# EAGLE schematic source_eagle (EAGLE 9.6.2)
COMPANY: ADAFRUIT INDUSTRIES; DRAWN: KTOWN; REV: A
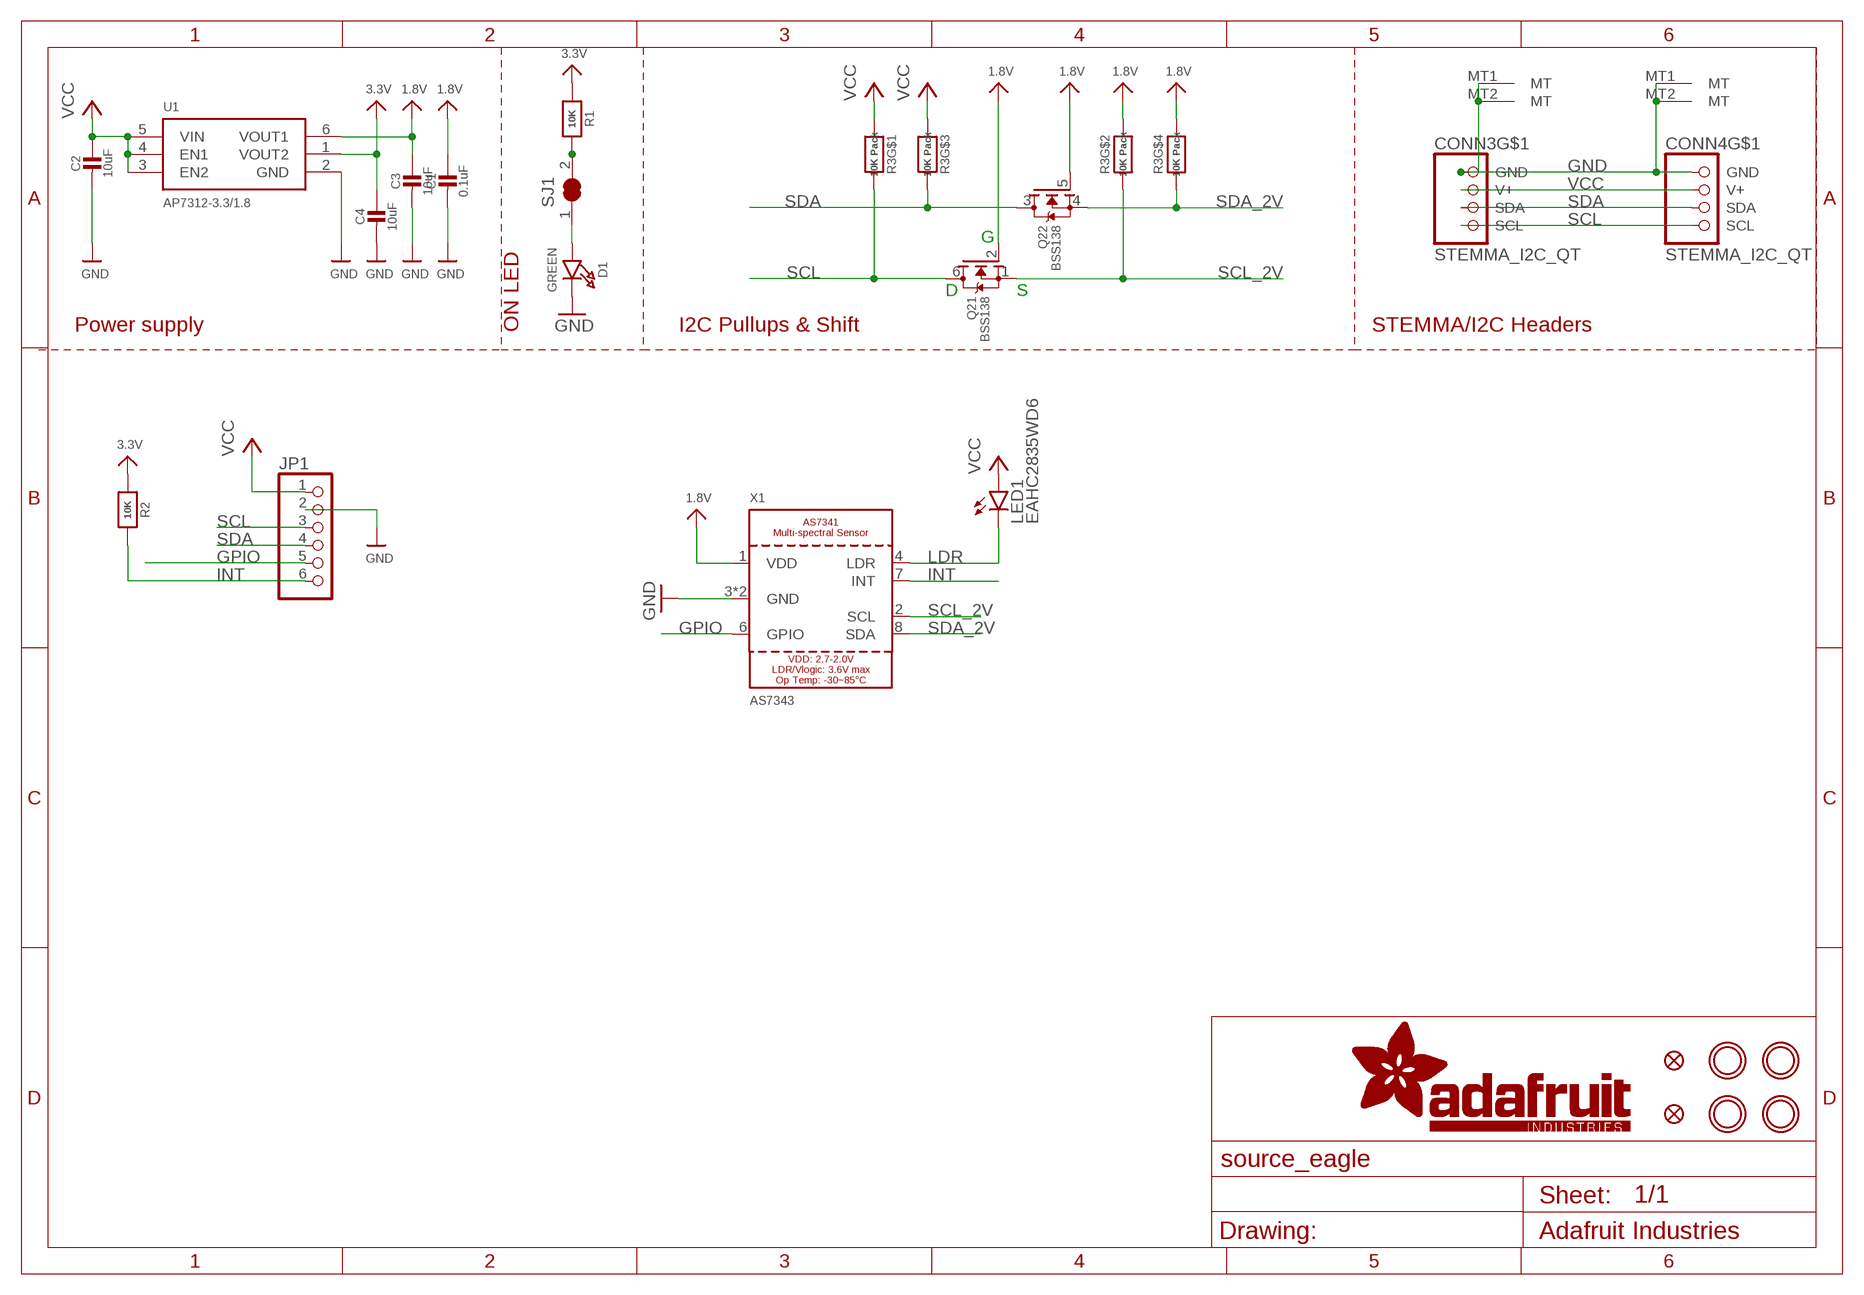
[diagram p0: schematic, sheet 1]

## Parts
C1  0.1uF  CAP_CERAMIC0603_NO  [0603-NO]
C2  10uF  CAP_CERAMIC0805-NOOUTLINE  [0805-NO]
C3  10uF  CAP_CERAMIC0805-NOOUTLINE  [0805-NO]
C4  10uF  CAP_CERAMIC0805-NOOUTLINE  [0805-NO]
CONN3  STEMMA_I2C_QT  [JST_SH4]
CONN4  STEMMA_I2C_QT  [JST_SH4]
D1  GREEN  LED0603_NOOUTLINE  [CHIPLED_0603_NOOUTLINE]
FID3  FIDUCIAL_0.5MM  [FIDUCIAL_0.5MM]
FID4  FIDUCIAL_0.5MM  [FIDUCIAL_0.5MM]
JP1  HEADER-1X670MIL  [1X06_ROUND_70]
LED1  EAHC2835WD6  LEDKA-3528ASYC  [KA-3528ASYC]
Q2  BSS138  MOSFET-N_DUAL  [SOT363]
R1  10K  RESISTOR_0603_NOOUT  [0603-NO]
R2  10K  RESISTOR_0603_NOOUT  [0603-NO]
R3  10K Pack  RESISTOR_4PACK  [RESPACK_4X0603]
SJ1  SOLDERJUMPER_CLOSED  [SOLDERJUMPER_CLOSEDWIRE]
U1  AP7312-3.3/1.8  VREG_SOT23-6_DUALAP7312  [SOT23-6]
U$1  MOUNTINGHOLE2.5  [MOUNTINGHOLE_2.5_PLATED]
U$17  MOUNTINGHOLE2.5  [MOUNTINGHOLE_2.5_PLATED]
U$19  MOUNTINGHOLE2.5  [MOUNTINGHOLE_2.5_PLATED]
U$21  MOUNTINGHOLE2.5  [MOUNTINGHOLE_2.5_PLATED]
X1  AS7343  AS7341  [AS7341]

## Nets
1.8V [lowpower]: C1.1 C3.1 Q2.2(1:G) Q2.5(2:G) R3.2 R3.4 U1.6(VOUT1) X1.1(VDD)
3.3V: C4.1 R1.1 R2.1 U1.1(VOUT2)
GND [highpower]: C1.2 C2.2 C3.2 C4.2 CONN3.1(GND) CONN3.MT1(MT) CONN3.MT2(MT) CONN4.1(GND) CONN4.MT1(MT) CONN4.MT2(MT) D1.C JP1.2 U1.2(GND) X1.3(GND) X1.5(GND)
GPIO: JP1.5 X1.6(GPIO)
INT: JP1.6 R2.2 X1.7(INT)
LDR: LED1.C X1.4(LDR)
N$1: D1.A SJ1.1
N$2: R1.2 SJ1.2
SCL: CONN3.4(SCL) CONN4.4(SCL) JP1.3 Q2.6(1:D) R3.8
SCL_2V: Q2.1(1:S) R3.7 X1.2(SCL)
SDA: CONN3.3(SDA) CONN4.3(SDA) JP1.4 Q2.3(2:D) R3.6
SDA_2V: Q2.4(2:S) R3.5 X1.8(SDA)
VCC [highpower]: C2.1 CONN3.2(V+) CONN4.2(V+) JP1.1 LED1.A R3.1 R3.3 U1.3(EN2) U1.4(EN1) U1.5(VIN)

## Notes on the sheet
- G
- D | S
- Power supply | ON LED | I2C Pullups & Shift | STEMMA/I2C Headers

## Library data of the parts
C1-C4 = microbuilder:CAP_CERAMIC: Ceramic Capacitors For new designs, use the packages preceded by an '_' character since they are more reliable: The following footprints should be used on most boards: _0402 - Standard footprint for regular board layouts _0603 - Standard footprint for regular board layouts _0805 - Standard footprint for regular board layouts _1206 - Standard footprint for regular board layouts For extremely tight-pitch boards where space is at a premium, the following 'micro-pitch' footprints can be used (smaller pads, no silkscreen outline, etc.): _0402MP - Micro-pitch footprint for very dense/compact boards _0603MP - Micro-pitch footprint for very dense/compact boards _0805MP - Micro-pitch footprint for very dense/compact boards _1206MP - Micro-pitch footprint for very dense/compact boards
CONN3 CONN4 = adafruit_electromech:STEMMA_I2C; LCSC: C2845363
D1 = microbuilder:LED: LED; ROT: 270
FID3 FID4 = microbuilder:FIDUCIAL: Fiducial Alignment Points Various fiducial points for machine vision alignment.
JP1 = microbuilder:HEADER-1X6: PIN HEADER
LED1 = led:LED: LED
Q2 = microbuilder:MOSFET-N_DUAL: Dual N-Channel MOSFET SOT363 (2.0x1.25mm) 2N7002PS - 60V, 320mA [Digikey: 568-5984-1-ND]; JLC_ROTATION: 270
R1 R2 = microbuilder:RESISTOR: Resistors For new designs, use the packages preceded by an '_' character since they are more reliable: The following footprints should be used on most boards: _0402 - Standard footprint for regular board layouts _0603 - Standard footprint for regular board layouts _0805 - Standard footprint for regular board layouts _1206 - Standard footprint for regular board layouts For extremely tight-pitch boards where space is at a premium, the following 'micro-pitch' footprints can be used (smaller pads, no silkscreen outline, etc.): _0402MP - Micro-pitch footprint for very dense/compact boards _0603MP - Micro-pitch footprint for very dense/compact boards _0805MP - Micro-pitch footprint for very dense/compact boards _1206MP - Micro-pitch footprint for very dense/compact boards
R3 = microbuilder:RESISTOR_4PACK: Resistor Packs (4 resistors) 4 x 0603 10K 1/16W - Digikey: YC164J-10KCT-ND
SJ1 = microbuilder:SOLDERJUMPER_CLOSED: Solder Jumper - Closed These solder jumpers are closed by default CLOSEDWIRE - 10 mil trace between pads that can be cut and resoldered later CLOSEDPERM - 63 mil trace between pads for a permanent connection (used to 'bridge' two signals, a shameless hack for Eagle). Can double as a test point as well (no cream layer)
U1 = adafruit_power:VREG_SOT23-6_DUAL: Dual Output SOT23-6 Linear Regulators Diodes Inc. AP7312 - Dual 150mA LDO Linear Regulator 0.2V dropout, 150mA output, 2-6V Input AP7312-1833W6-7 - 1.8V/3.3V SOT23-6 (Digikey: AP7312-1833W6-7DICT-ND) MIC5320 - Dual 150mA ULDO Linear Regulator Ultra-low 35mV dropout at 150mA, 2.3-5.5V Input 3.3V/1.8V SOT23-6 (Digikey: 576-1658-1-ND) 3.3V/1.5V SOT23-6 (Digikey: 576-3483-1-ND)
U$1 U$17 U$19 U$21 = adafruit_electromech:MOUNTINGHOLE: Mounting Hole For #2 screws (0.086"/2.18mm width, 0.094"/2.4mm hole) use 2.5mm; BOM: EXCLUDE
X1 = adafruit_sensor:AS7341

## Net classes
1 highpower: width 0.305 mm, drill 0.483 mm
2 lowpower: width 0.254 mm, drill 0.483 mm